# Altium project MultiSpikeHold.PrjPcb
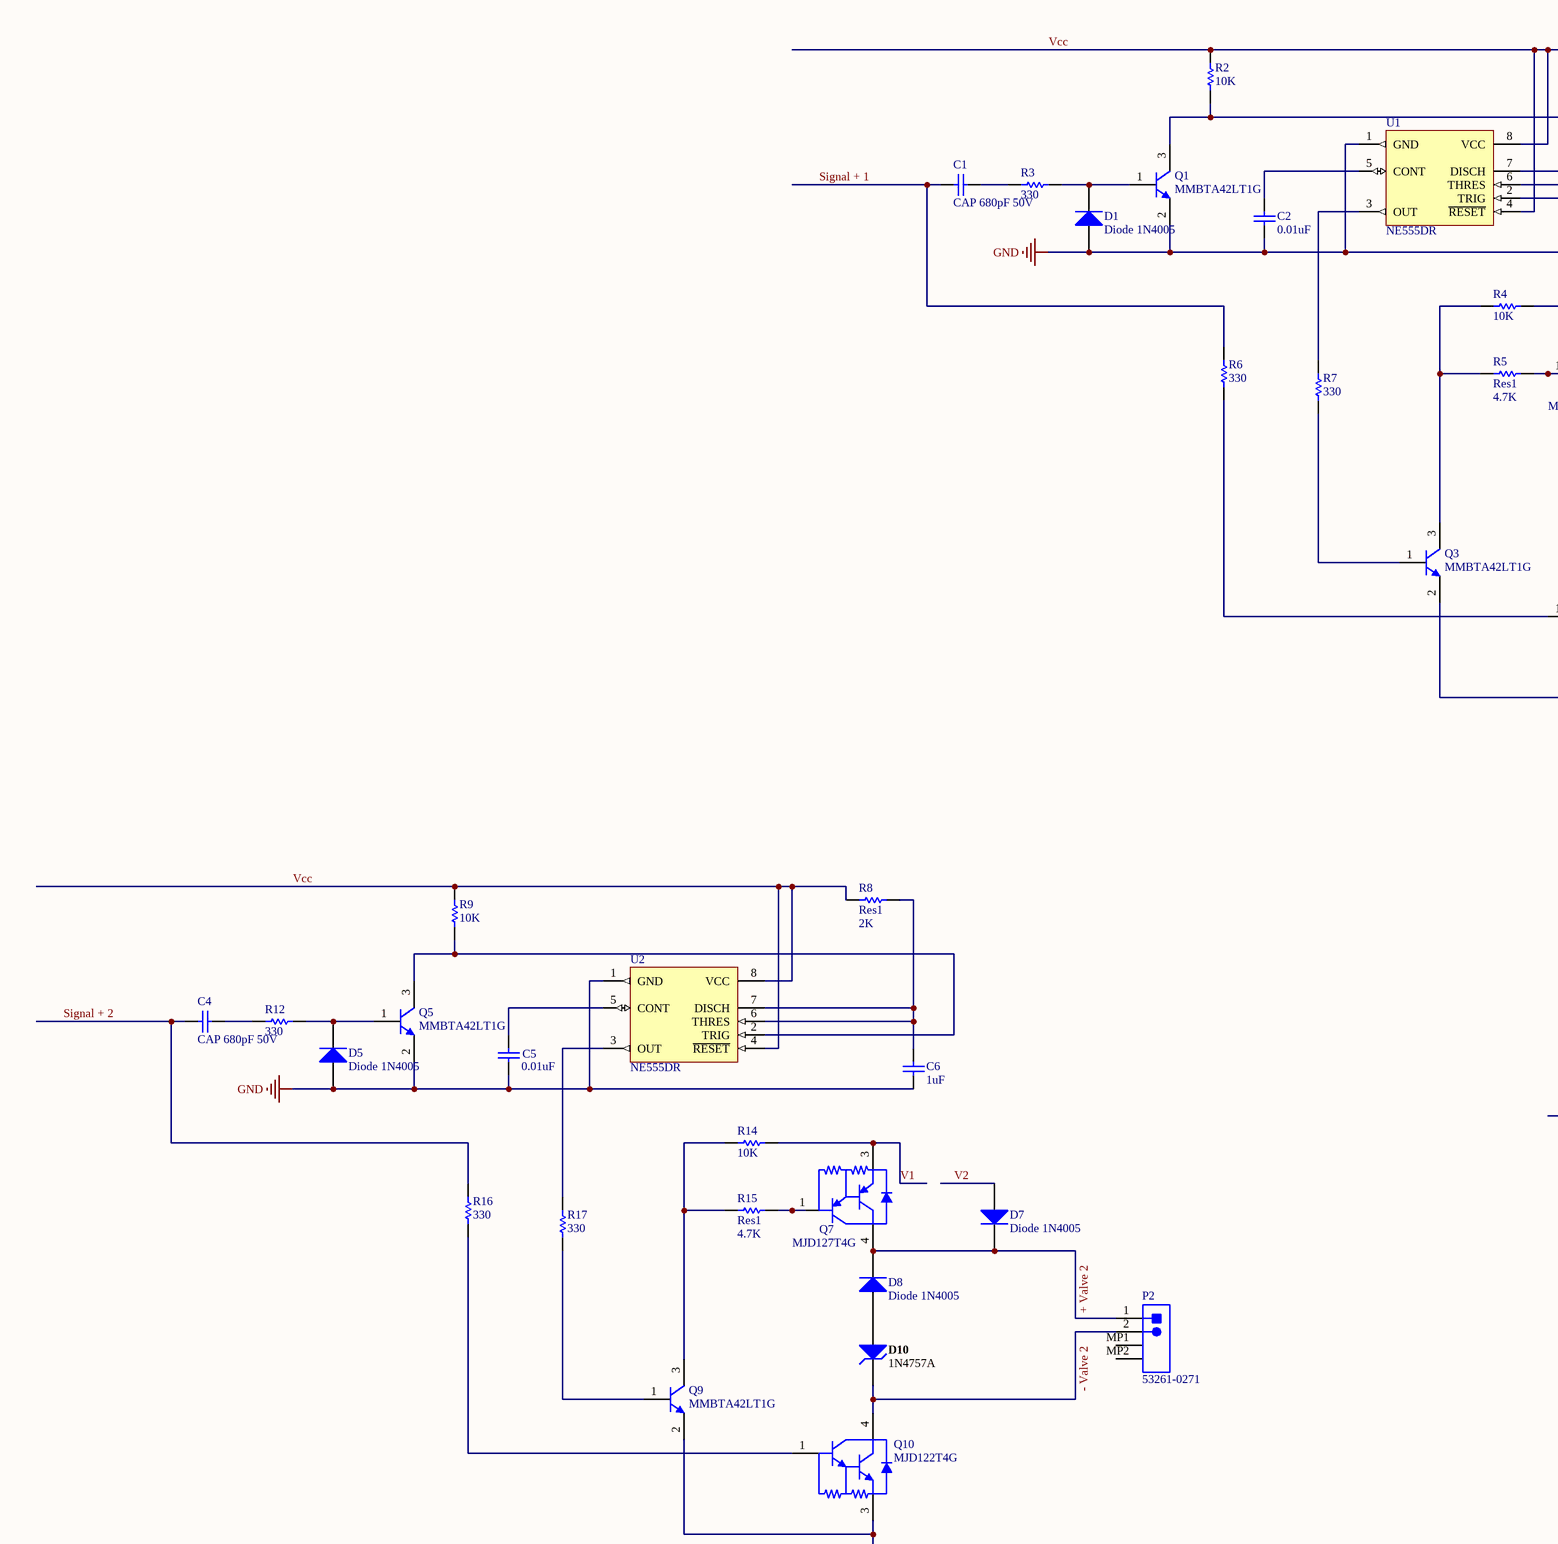
[diagram p0: MultiSpikeHoldSchem.SchDoc, top left]
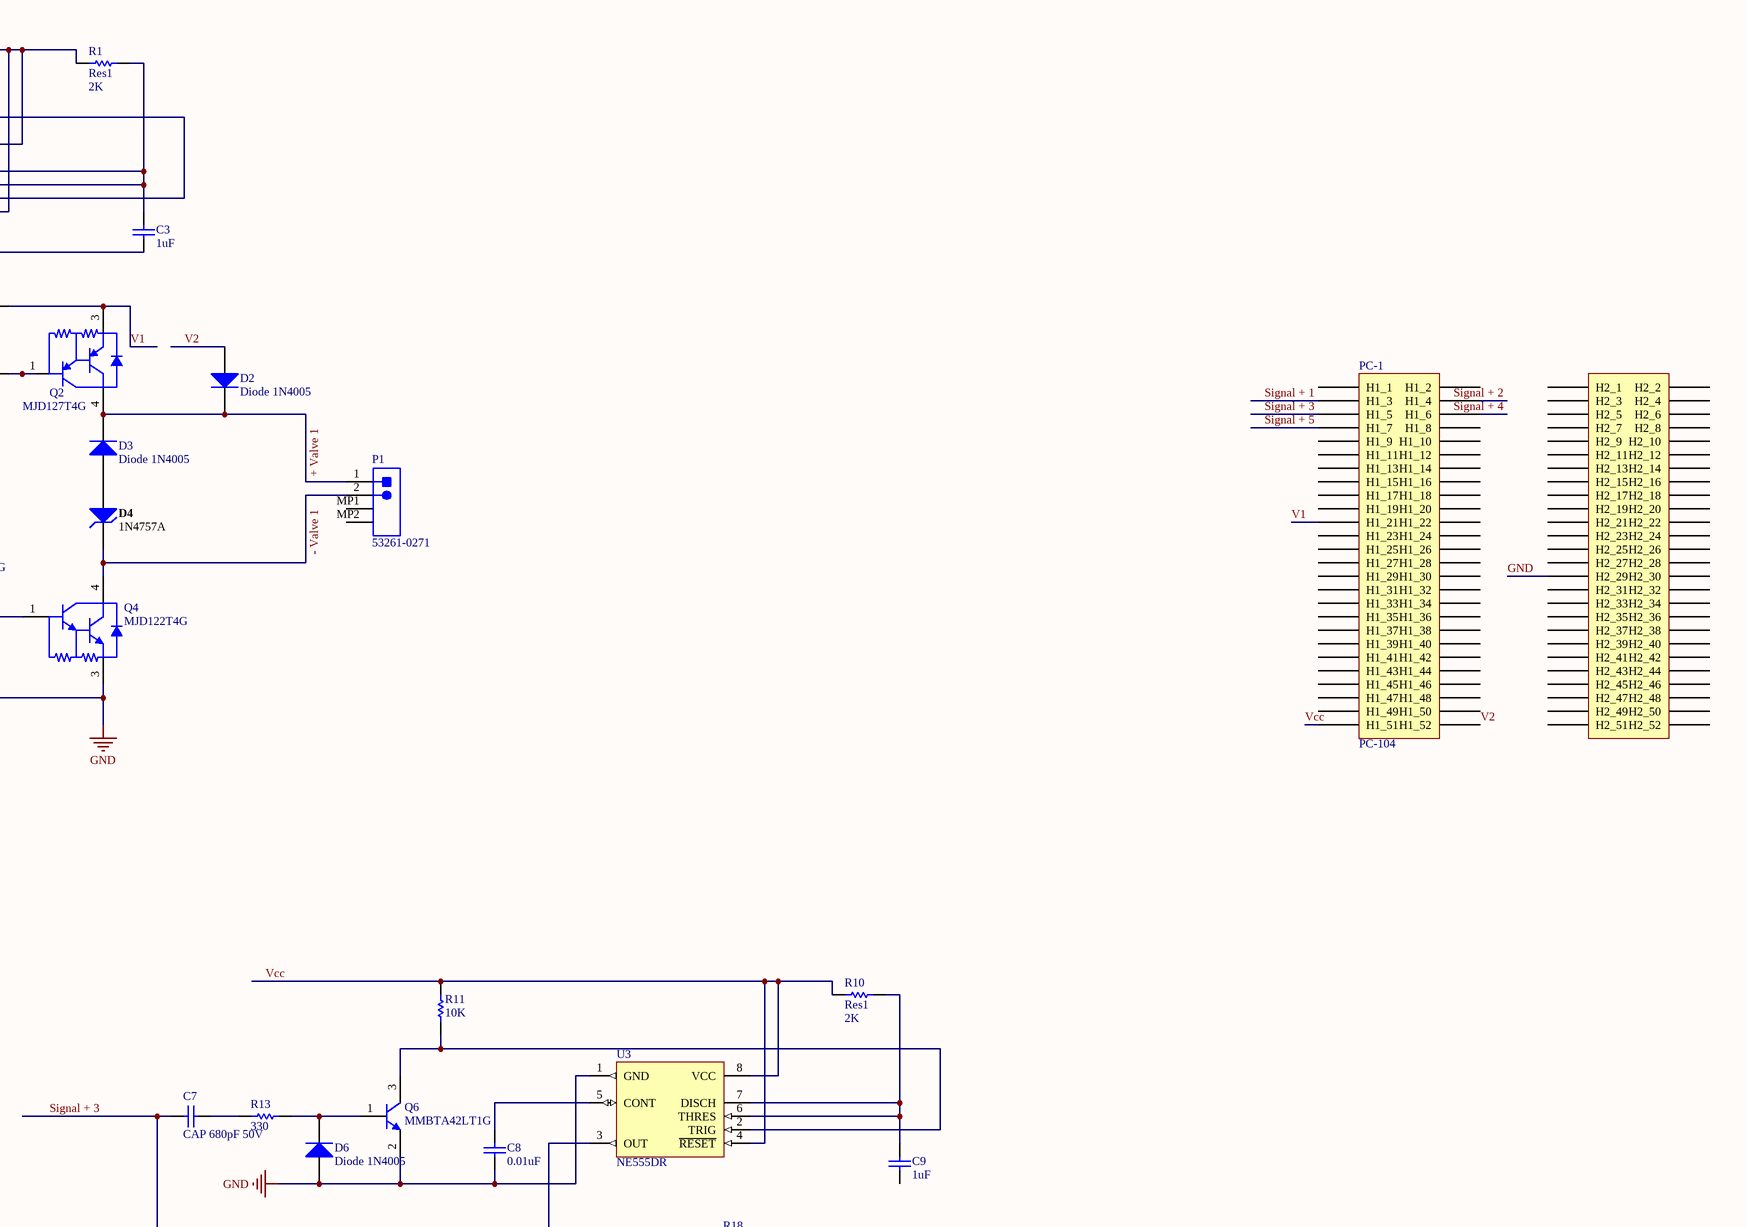
[diagram p1: MultiSpikeHoldSchem.SchDoc, top right]
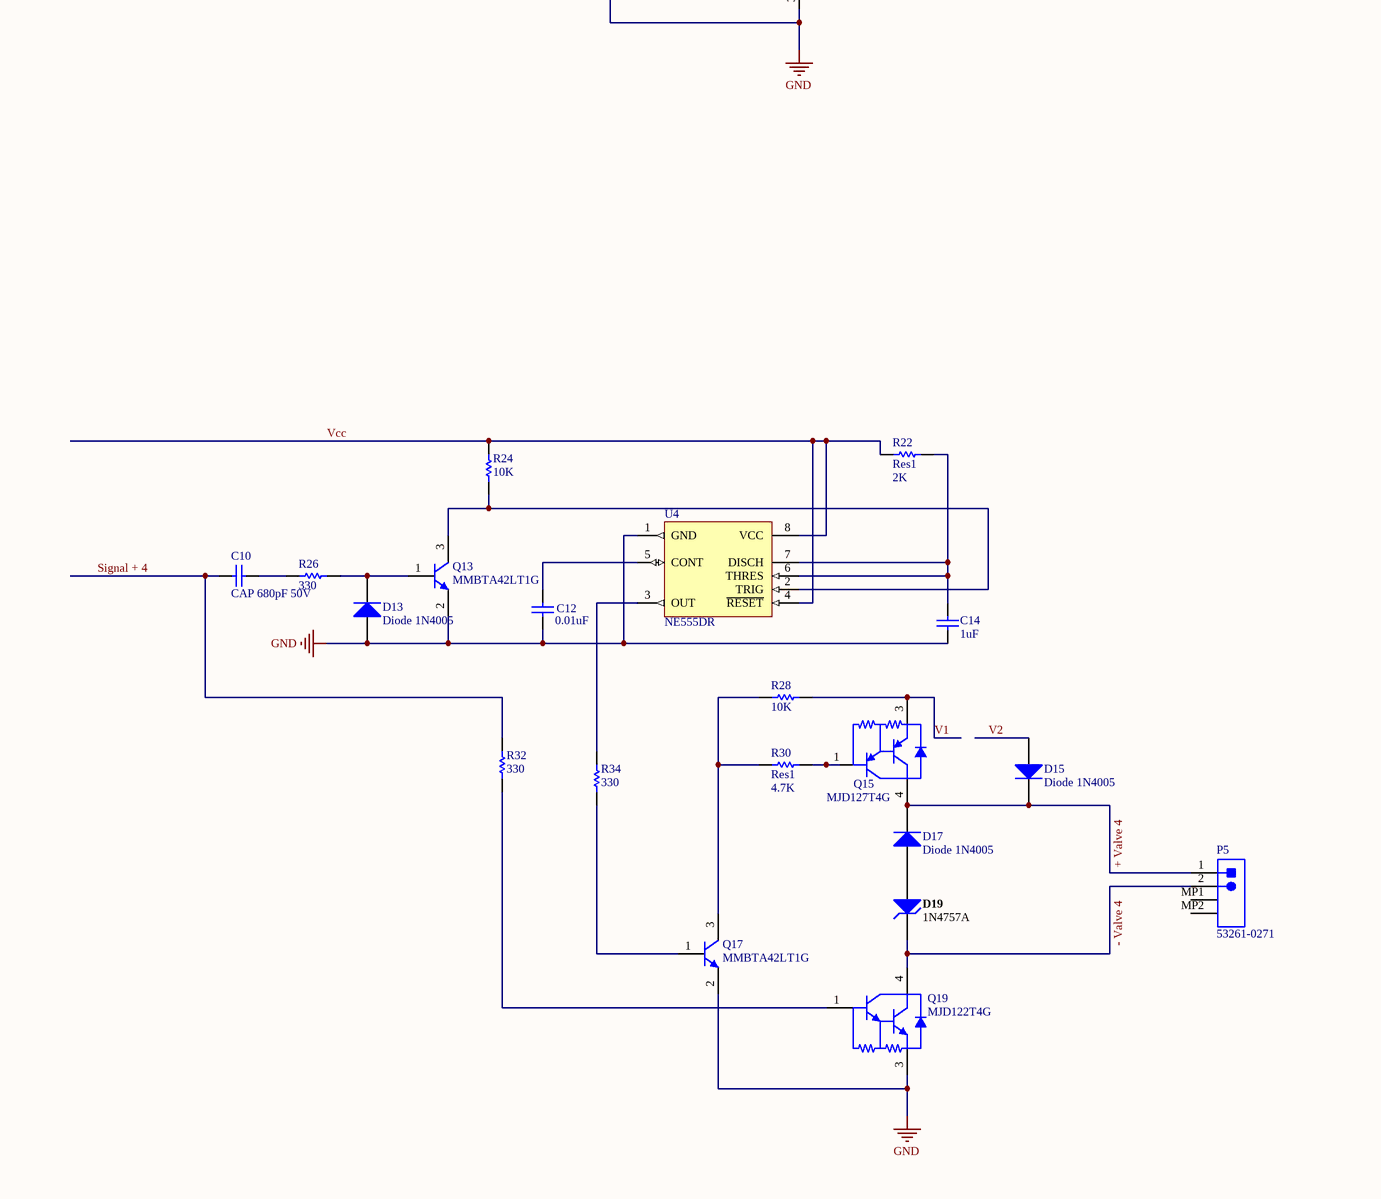
[diagram p2: MultiSpikeHoldSchem.SchDoc, bottom left]
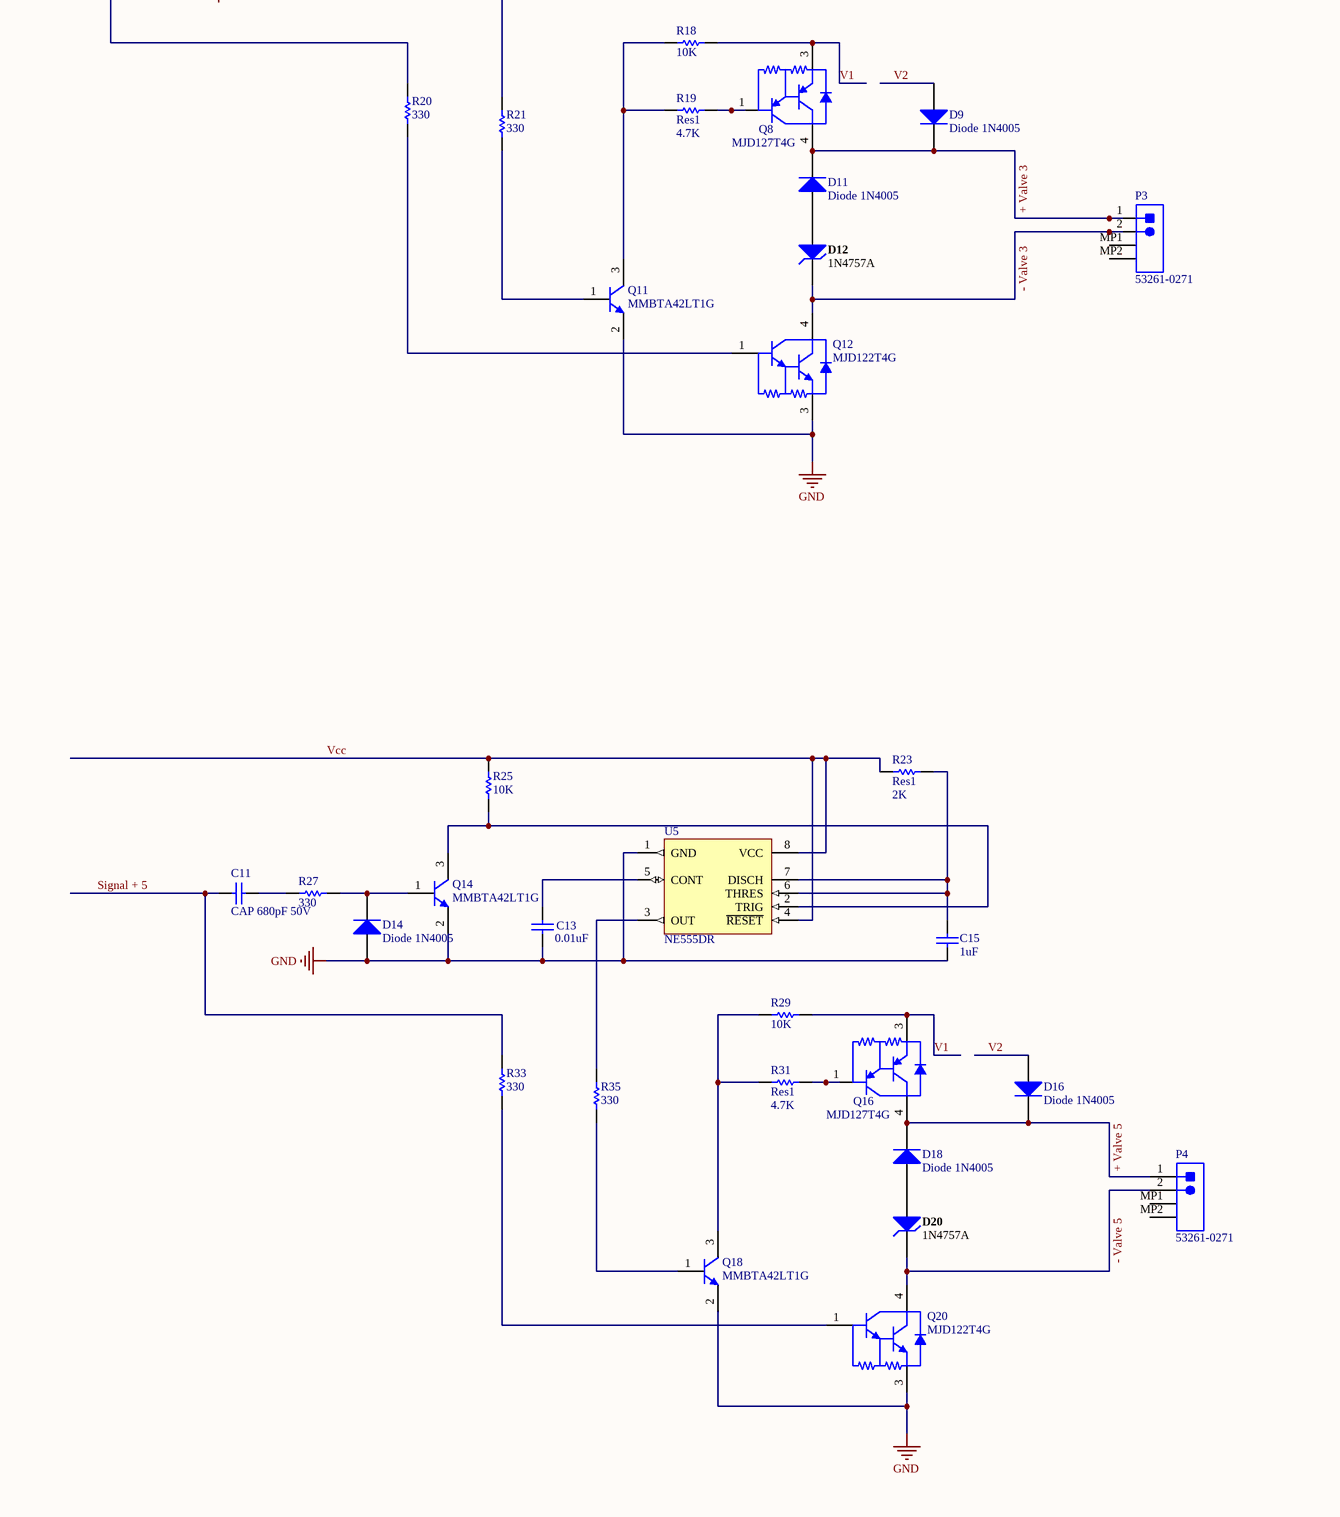
[diagram p3: MultiSpikeHoldSchem.SchDoc, bottom right]
1 sheet, 101 parts. Net scope: global (net labels, ports and power ports of the same name join across sheets).
Board file: MultiSpikeHoldPCB.PcbDoc

## Sheet MultiSpikeHoldSchem.SchDoc
size A1

### Parts
C1  CAP 680pF 50V  [CAPC1812(4532)230_L]
C2  0.01uF  [CAPC2013X70X45ML10T25]
C3  1uF  [CAPC1206(3216)110_L]
C4  CAP 680pF 50V  [CAPC1812(4532)230_L]
C5  0.01uF  [CAPC2013X70X45ML10T25]
C6  1uF  [CAPC1206(3216)110_L]
C7  CAP 680pF 50V  [CAPC1812(4532)230_L]
C8  0.01uF  [CAPC2013X70X45ML10T25]
C9  1uF  [CAPC1206(3216)110_L]
C10  CAP 680pF 50V  [CAPC1812(4532)230_L]
C11  CAP 680pF 50V  [CAPC1812(4532)230_L]
C12  0.01uF  [CAPC2013X70X45ML10T25]
C13  0.01uF  [CAPC2013X70X45ML10T25]
C14  1uF  [CAPC1206(3216)110_L]
C15  1uF  [CAPC1206(3216)110_L]
D1  Diode 1N4005  [DO-41]
D2  Diode 1N4005  [DO-41]
D3  Diode 1N4005  [DO-41]
D4  1N4757A  [FAIR-DO-41-2_V]
D5  Diode 1N4005  [DO-41]
D6  Diode 1N4005  [DO-41]
D7  Diode 1N4005  [DO-41]
D8  Diode 1N4005  [DO-41]
D9  Diode 1N4005  [DO-41]
D10  1N4757A  [FAIR-DO-41-2_V]
D11  Diode 1N4005  [DO-41]
D12  1N4757A  [FAIR-DO-41-2_V]
D13  Diode 1N4005  [DO-41]
D14  Diode 1N4005  [DO-41]
D15  Diode 1N4005  [DO-41]
D16  Diode 1N4005  [DO-41]
D17  Diode 1N4005  [DO-41]
D18  Diode 1N4005  [DO-41]
D19  1N4757A  [FAIR-DO-41-2_V]
D20  1N4757A  [FAIR-DO-41-2_V]
P1  53261-0271  [MOLX-53261-0271_V]
P2  53261-0271  [MOLX-53261-0271_V]
P3  53261-0271  [MOLX-53261-0271_V]
P4  53261-0271  [MOLX-53261-0271_V]
P5  53261-0271  [MOLX-53261-0271_V]
PC-1  PC-104  [PC-104FOOTPRINT]
Q1  MMBTA42LT1G  [ONSC-SOT-23-3-318-08_V]
Q2  MJD127T4G  [ONSC-DPAK-3-369C-01_V]
Q3  MMBTA42LT1G  [ONSC-SOT-23-3-318-08_V]
Q4  MJD122T4G  [ONSC-DPAK-3-369C-01_V]
Q5  MMBTA42LT1G  [ONSC-SOT-23-3-318-08_V]
Q6  MMBTA42LT1G  [ONSC-SOT-23-3-318-08_V]
Q7  MJD127T4G  [ONSC-DPAK-3-369C-01_V]
Q8  MJD127T4G  [ONSC-DPAK-3-369C-01_V]
Q9  MMBTA42LT1G  [ONSC-SOT-23-3-318-08_V]
Q10  MJD122T4G  [ONSC-DPAK-3-369C-01_V]
Q11  MMBTA42LT1G  [ONSC-SOT-23-3-318-08_V]
Q12  MJD122T4G  [ONSC-DPAK-3-369C-01_V]
Q13  MMBTA42LT1G  [ONSC-SOT-23-3-318-08_V]
Q14  MMBTA42LT1G  [ONSC-SOT-23-3-318-08_V]
Q15  MJD127T4G  [ONSC-DPAK-3-369C-01_V]
Q16  MJD127T4G  [ONSC-DPAK-3-369C-01_V]
Q17  MMBTA42LT1G  [ONSC-SOT-23-3-318-08_V]
Q18  MMBTA42LT1G  [ONSC-SOT-23-3-318-08_V]
Q19  MJD122T4G  [ONSC-DPAK-3-369C-01_V]
Q20  MJD122T4G  [ONSC-DPAK-3-369C-01_V]
R1  Res1  value 2K  [AXIAL-0.3]
R2  10K  [RESC1608X55X25ML10T15]
R3  330  [RESC3116X65X40LL10T20]
R4  10K  [RESC1608X55X25ML10T15]
R5  Res1  value 4.7K  [AXIAL-0.3]
R6  330  [RESC3116X65X40LL10T20]
R7  330  [RESC3116X65X40LL10T20]
R8  Res1  value 2K  [AXIAL-0.3]
R9  10K  [RESC1608X55X25ML10T15]
R10  Res1  value 2K  [AXIAL-0.3]
R11  10K  [RESC1608X55X25ML10T15]
R12  330  [RESC3116X65X40LL10T20]
R13  330  [RESC3116X65X40LL10T20]
R14  10K  [RESC1608X55X25ML10T15]
R15  Res1  value 4.7K  [AXIAL-0.3]
R16  330  [RESC3116X65X40LL10T20]
R17  330  [RESC3116X65X40LL10T20]
R18  10K  [RESC1608X55X25ML10T15]
R19  Res1  value 4.7K  [AXIAL-0.3]
R20  330  [RESC3116X65X40LL10T20]
R21  330  [RESC3116X65X40LL10T20]
R22  Res1  value 2K  [AXIAL-0.3]
R23  Res1  value 2K  [AXIAL-0.3]
R24  10K  [RESC1608X55X25ML10T15]
R25  10K  [RESC1608X55X25ML10T15]
R26  330  [RESC3116X65X40LL10T20]
R27  330  [RESC3116X65X40LL10T20]
R28  10K  [RESC1608X55X25ML10T15]
R29  10K  [RESC1608X55X25ML10T15]
R30  Res1  value 4.7K  [AXIAL-0.3]
R31  Res1  value 4.7K  [AXIAL-0.3]
R32  330  [RESC3116X65X40LL10T20]
R33  330  [RESC3116X65X40LL10T20]
R34  330  [RESC3116X65X40LL10T20]
R35  330  [RESC3116X65X40LL10T20]
U1  NE555DR  [D0008A_L]
U2  NE555DR  [D0008A_L]
U3  NE555DR  [D0008A_L]
U4  NE555DR  [D0008A_L]
U5  NE555DR  [D0008A_L]

### Nets
GND: C2.1 C3.1 C5.1 C6.1 C8.1 C12.1 C13.1 C14.1 C15.1 D1.1(A) D5.1(A) D6.1(A) D13.1(A) D14.1(A) PC-1.H2_29 Q1.2(E) Q3.2(E) Q4.3(E) Q5.2(E) Q6.2(E) Q9.2(E) Q10.3(E) Q11.2(E) Q12.3(E) Q13.2(E) Q14.2(E) Q17.2(E) Q18.2(E) Q19.3(E) Q20.3(E) U1.1(GND) U2.1(GND) U3.1(GND) U4.1(GND) U5.1(GND)
+ Valve 1: D2.2(K) D3.2(K) P1.1 Q2.4(C)
+ Valve 2: D7.2(K) D8.2(K) P2.1 Q7.4(C)
+ Valve 3: D9.2(K) D11.2(K) P3.1 Q8.4(C)
+ Valve 4: D15.2(K) D17.2(K) P5.1 Q15.4(C)
+ Valve 5: D16.2(K) D18.2(K) P4.1 Q16.4(C)
- Valve 1: D4.2(K) P1.2 Q4.4(C)
- Valve 2: D10.2(K) P2.2 Q10.4(C)
- Valve 3: D12.2(K) P3.2 Q12.4(C)
- Valve 4: D19.2(K) P5.2 Q19.4(C)
- Valve 5: D20.2(K) P4.2 Q20.4(C)
Signal + 1: C1.1 PC-1.H1_3 R6.2
Signal + 2: C4.1 R16.2
Signal + 3: C7.1 PC-1.H1_5 R20.2
Signal + 4: C10.1 R32.2
Signal + 5: C11.1 PC-1.H1_7 R33.2
V1: PC-1.H1_21 Q2.3(E) Q7.3(E) Q8.3(E) Q15.3(E) Q16.3(E) R4.2 R14.1 R18.1 R28.2 R29.2
V2: D2.1(A) D7.1(A) D9.1(A) D15.1(A) D16.1(A) PC-1.H1_52
Vcc: PC-1.H1_51 R1.1 R2.1 R8.1 R9.2 R10.1 R11.1 R22.1 R23.1 R24.1 R25.1 U1.4(~{RESET}) U1.8(VCC) U2.4(~{RESET}) U2.8(VCC) U3.4(~{RESET}) U3.8(VCC) U4.4(~{RESET}) U4.8(VCC) U5.4(~{RESET}) U5.8(VCC)
NetC1_2: C1.2 R3.1
NetC2_2: C2.2 U1.5(CONT)
NetC3_2: C3.2 R1.2 U1.6(THRES) U1.7(DISCH)
NetC4_2: C4.2 R12.1
NetC5_2: C5.2 U2.5(CONT)
NetC6_2: C6.2 R8.2 U2.6(THRES) U2.7(DISCH)
NetC7_2: C7.2 R13.1
NetC8_2: C8.2 U3.5(CONT)
NetC9_2: C9.2 R10.2 U3.6(THRES) U3.7(DISCH)
NetC10_2: C10.2 R26.1
NetC11_2: C11.2 R27.1
NetC12_2: C12.2 U4.5(CONT)
NetC13_2: C13.2 U5.5(CONT)
NetC14_2: C14.2 R22.2 U4.6(THRES) U4.7(DISCH)
NetC15_2: C15.2 R23.2 U5.6(THRES) U5.7(DISCH)
NetD1_2: D1.2(K) Q1.1(B) R3.2
NetD3_1: D3.1(A) D4.1(A)
NetD5_2: D5.2(K) Q5.1(B) R12.2
NetD6_2: D6.2(K) Q6.1(B) R13.2
NetD8_1: D8.1(A) D10.1(A)
NetD11_1: D11.1(A) D12.1(A)
NetD13_2: D13.2(K) Q13.1(B) R26.2
NetD14_2: D14.2(K) Q14.1(B) R27.2
NetD17_1: D17.1(A) D19.1(A)
NetD18_1: D18.1(A) D20.1(A)
NetQ1_3: Q1.3(C) R2.2 U1.2(TRIG)
NetQ2_1: Q2.1(B) R5.2
NetQ3_1: Q3.1(B) R7.1
NetQ3_3: Q3.3(C) R4.1 R5.1
NetQ4_1: Q4.1(B) R6.1
NetQ5_3: Q5.3(C) R9.1 U2.2(TRIG)
NetQ6_3: Q6.3(C) R11.2 U3.2(TRIG)
NetQ7_1: Q7.1(B) R15.2
NetQ8_1: Q8.1(B) R19.2
NetQ9_1: Q9.1(B) R17.1
NetQ9_3: Q9.3(C) R14.2 R15.1
NetQ10_1: Q10.1(B) R16.1
NetQ11_1: Q11.1(B) R21.1
NetQ11_3: Q11.3(C) R18.2 R19.1
NetQ12_1: Q12.1(B) R20.1
NetQ13_3: Q13.3(C) R24.2 U4.2(TRIG)
NetQ14_3: Q14.3(C) R25.2 U5.2(TRIG)
NetQ15_1: Q15.1(B) R30.2
NetQ16_1: Q16.1(B) R31.2
NetQ17_1: Q17.1(B) R34.1
NetQ17_3: Q17.3(C) R28.1 R30.1
NetQ18_1: Q18.1(B) R35.1
NetQ18_3: Q18.3(C) R29.1 R31.1
NetQ19_1: Q19.1(B) R32.1
NetQ20_1: Q20.1(B) R33.1
NetR7_2: R7.2 U1.3(OUT)
NetR17_2: R17.2 U2.3(OUT)
NetR21_2: R21.2 U3.3(OUT)
NetR34_2: R34.2 U4.3(OUT)
NetR35_2: R35.2 U5.3(OUT)

Not connected (* = marked no-connect by the designer): C9 1; P1 MP1 MP2; P2 MP1 MP2; P3 MP1 MP2; P4 MP1 MP2; P5 MP1 MP2; PC-1 H1_1 H1_2 H1_4 H1_6 H1_8 H1_9 H1_10 H1_11 H1_12 H1_13 H1_14 H1_15 H1_16 H1_17 H1_18 H1_19 H1_20 H1_22 H1_23 H1_24 H1_25 H1_26 H1_27 H1_28 H1_29 H1_30 H1_31 H1_32 H1_33 H1_34 H1_35 H1_36 H1_37 H1_38 H1_39 H1_40 H1_41 H1_42 H1_43 H1_44 H1_45 H1_46 H1_47 H1_48 H1_49 H1_50 H2_1 H2_2 H2_3 H2_4 H2_5 H2_6 H2_7 H2_8 H2_9 H2_10 H2_11 H2_12 H2_13 H2_14 H2_15 H2_16 H2_17 H2_18 H2_19 H2_20 H2_21 H2_22 H2_23 H2_24 H2_25 H2_26 H2_27 H2_28 H2_30 H2_31 H2_32 H2_33 H2_34 H2_35 H2_36 H2_37 H2_38 H2_39 H2_40 H2_41 H2_42 H2_43 H2_44 H2_45 H2_46 H2_47 H2_48 H2_49 H2_50 H2_51 H2_52

### Notes on the sheet
- Labels drawn without touching a wire or pin: Signal + 2, Signal + 4

### Library data of the parts
C1 C4 C7 C10 C11 = CMP-1040-00233-1: CAP 680pF 50V ±5% 1812 (4532 Metric) Thickness 2.3mm SMD; Case-EIA: 1812; Case-Metric: 4532; Tolerance: Â±5%; Rated Voltage: 50 V; Technology: SMT; Value: 680pF; Max Thickness: 2.3 mm
C2 C5 C8 C12 C13 = CMP-2000-05013-1: Chip Capacitor, 10 nF, +/- 10%, 50 V, -55 to 125 degC, 0805 (2012 Metric), RoHS, Tape and Reel; Manufacturer: Murata; Voltage Rating DC: 50V; Temperature Coefficient / Code: +/-15%; Capacitance - pF: 10000pF; Case Height: 0.6mm; Dielectric: X7R; Case Length: 2mm; Case Width: 1.25mm; Type: GeneralPurposeMLCC; Brand: MurataElectronics; Capacitance - nF: 10nF; Capacitance: 0.01uF; Tolerance: 10%; Product Category: MultilayerCeramicCapacitorsMLCC-SMD/SMT; Minimum Operating Temperature: -55C; Voltage Rating: 50V; Series: GRM; Packaging: Reel; Dimensions: 1.25mmWx2mmLx0.6mmH; Operating Temperature Range: -55Cto+125C; Package / Case: 0805(2012metric); Datasheet URL: https://datasheet.ciiva.com/29201/452521-da-01-en-vs-kondensator-0805-29201121.pdf; Maximum Operating Temperature: +125C; Factory Pack Quantity: 4000; Case Code - in: 0805; Case Code - mm: 2012; Manufacturer URL: http://www.murata.com/; Termination Style: SMD/SMT; Datasheet Version: Dec-10; RoHS: Details; Product: GeneralTypeMLCCs
C3 C6 C9 C14 C15 = CMP-1037-04718-1: CAP 1uF 50V ±10% 1206 (3216 Metric) Thickness 1.1mm SMD; Tolerance: Â±10%; Case-EIA: 1206; Case-Metric: 3216; Rated Voltage: 50 V; Max Thickness: 1.1 mm; Value: 1uF; Technology: SMT
D1-D3 D5-D9 D11 D13-D18 = Diode 1N4005: 1 Amp General Purpose Rectifier; Published: 8-Jun-2000; LatestRevisionDate: 17-Jul-2002; LatestRevisionNote: Re-released for DXP Platform.; DatasheetVersion: 1998; PackageVersion: Aug-1999; PackageReference: DO-41; Publisher: Altium Limited; PackageDescription: Diode, Axial; Body 5.2 x 2.7 mm (LxDia. max), Lead Dia. 0.86 mm (max); Code_JEDEC: DO-204-AL; ComponentLink1Description: Manufacturer Link; ComponentLink1URL: http://www.fairchildsemi.com/; ComponentLink2Description: Datasheet; ComponentLink2URL: http://www.fairchildsemi.com/ds/1N%2F1N4001.pdf
D4 D10 D12 D19 D20 = CMP-0892-00018-1: Zener Diode, 51V, 1W, 5%, -65 to 200 degC, 2-Pin DO-41, Body 2.72 x 5.2 mm, RoHS; Manufacturer: Fairchild Semiconductor; Test Current IZ (mA): 5; ZZ (Max) (ohm): 95; VZ (Min.) (V): 48.45; VZ (Max.) (V): 53.55; PD (W): 1; Mounting Technology: Through Hole; ComponentLink2Description: Datasheet; ComponentLink1Description: Manufacturer URL; ComponentLink2URL: http://www.fairchildsemi.com/ds/1N/1N4744A.pdf; PackageReference: DO-41-2; PartNumber: 1N4757A; Tolerance: 5%; ComponentLink3URL: http://www.fairchildsemi.com/dwg/DO/DO41A.pdf; IR (uA): 5; PackageDescription: 2-Pin Axial leaded, Body 2.72 x 5.2 mm, Lead Spread 25.4 mm; ComponentLink3Description: Package Specification; RoHS: TRUE; DatasheetVersion: Rev. H3; ComponentLink1URL: http://www.fairchildsemi.com/; PackageVersion: Rev. 2; Operating and Storage Temperature Range: -65 to 200 degC
P1-P5 = CMP-2000-05633-1: PicoBlade(TM) Header, Right Angle, -40 to 85 degC, 2-Pin SMD, RoHS, Tape and Reel; Current - Max: 1A; Brand: Molex; Voltage Rating: 125V; Number of Positions: 2; Pitch: 1.25mm; Package Version: Rev. H, 11/2014; Factory Pack Quantity: 1000; Datasheet URL: http://www.molex.com/webdocs/datasheets/pdf/en-us/0532610271_PCB_HEADERS.pdf; Datasheet Version: 03/2016; Housing Material: Thermoplastic; RoHS: Details; Product Type: Headers; Number of Rows: 1; Termination Style: SMD; Mounting Technology: SurfaceMount; Number of Positions / Contacts: 2; Package URL: http://www.molex.com/pdm_docs/sd/532610271_sd.pdf; Mounting Angle: Right; Mounting Style: SMD/SMT; Manufacturer: Molex; Product Category: 1.25mmConnectors; Tradename: PicoBlade; Voltage - Max: 125V; Manufacturer URL: http://www.molex.com/; Series: 53261; Package Description: 2-Leads Header, Pitch 1.25 mm, Mated Height 3.4 mm; Package Reference: 53261-0271; Current Rating: 1A; Contact Plating: Tin; Contact Material: PhosphorBronze; Type: Shrouded; Packaging: Reel
Q1 Q3 Q5 Q6 Q9 Q11 Q13 Q14 Q17 Q18 = CMP-1048-00662-1: High Voltage Transistor, NPN Silicon, 3-Pin SOT-23, Pb-Free, Tape and Reel; Manufacturer: On Semiconductor; fT Min (MHz): 50; IC Continuous (A): 0.5; ComponentLink1URL: http://www.onsemi.com/; ComponentLink3URL: http://www.onsemi.cn/pub_link/Collateral/318-08.PDF; RoHS: TRUE; ComponentLink2Description: Datasheet; PartNumber: MMBTA42LT1G; Polarity: NPN; DatasheetVersion: Rev. 12; PackageReference: SOT-23-3-318-08; PackageDescription: 3-Pin Small Outline Transistor, Body 2.92 x 1.3 mm, Pitch 0.95 mm; ComponentLink3Description: Package Specification; ComponentLink1Description: Manufacturer URL; Packing: Tape and Reel; PackageVersion: Rev. AP, 11/2009; Mounting Technology: Surface Mount; ComponentLink2URL: http://www.onsemi.cn/pub_link/Collateral/MMBTA42LT1-D.PDF
Q2 Q7 Q8 Q15 Q16 = CMP-1047-00009-1: Complementary Darlington Power Transistor, 3-Pin DPAK, Pb-Free, Tape and Reel; Manufacturer: On Semiconductor; Polarity: PNP; IC Continuous (A): 8; hFE Max (k): 12; ComponentLink3URL: http://www.onsemi.cn/pub_link/Collateral/369C.PDF; PackageReference: DPAK-3-369C-01; RoHS: TRUE; PartNumber: MJD127T4G; ComponentLink2URL: http://www.onsemi.com/pub_link/Collateral/MJD122-D.PDF; PackageDescription: 3-Pin Flange Mount, Body 6.54 x 6.095 mm, Pitch 2.29 mm; Mounting Technology: Surface Mount; Packing: Tape and Reel; DatasheetVersion: Rev. 13; ComponentLink2Description: Datasheet; ComponentLink3Description: Package Specification; ComponentLink1URL: http://www.onsemi.com/; ComponentLink1Description: Manufacturer URL; PackageVersion: Rev. E, 02/2014
Q4 Q10 Q12 Q19 Q20 = CMP-1047-00007-1: Complementary Darlington Power Transistor, 3-Pin DPAK, Pb-Free, Tape and Reel; Manufacturer: On Semiconductor; IC Continuous (A): 8; hFE Max (k): 12; Polarity: NPN; ComponentLink1Description: Manufacturer URL; ComponentLink3URL: http://www.onsemi.cn/pub_link/Collateral/369C.PDF; Mounting Technology: Surface Mount; RoHS: TRUE; ComponentLink2Description: Datasheet; ComponentLink1URL: http://www.onsemi.com/; ComponentLink3Description: Package Specification; DatasheetVersion: Rev. 13; PackageDescription: 3-Pin Flange Mount, Body 6.54 x 6.095 mm, Pitch 2.29 mm; PartNumber: MJD122T4G; ComponentLink2URL: http://www.onsemi.com/pub_link/Collateral/MJD122-D.PDF; PackageVersion: Rev. E, 02/2014; PackageReference: DPAK-3-369C-01; Packing: Tape and Reel
R1 R5 R8 R10 R15 R19 R22 R23 R30 R31 = Res1: Resistor; Published: 8-Jun-2000; LatestRevisionDate: 17-Jul-2002; LatestRevisionNote: Re-released for DXP Platform.; PackageReference: AXIAL-0.3; Publisher: Altium Limited; PackageDescription: Axial Device, Thru-Hole; 2 Leads; 0.3 in Pin Spacing
R2 R4 R9 R11 R14 R18 R24 R25 R28 R29 = CMP-2100-03664-1: Chip Resistor, 10 KOhm, +/- 1%, 01 W, -55 to 155 degC, 0603 (1608 Metric), RoHS, Tape and Reel; Manufacturer: Yageo; Temperature Coefficient: 100ppm/degreesC; Resistance: 10KOhm; Voltage Rating: 75V; Power Rating: 100mW; Voltage Rating (DC): 50V; Composition: ThickFilm; RoHSCompliant: true; Height: 0.45mm; Lead Free: LeadFree; Case Code (Metric): 1608; Case/Package: 0603; Datasheet Version: Rev. 5, 10/2016; Package Reference: 0603; Depth: 0.8mm; Package Description: 2-Pin Surface Mount Device, Body 1.6 x 0.8 mm; Case Code (Imperial): 0603; Packaging: TapeandReel; Termination: SMD/SMT; Lead Pitch: 0.3mm; Width: 0.8mm; Number of Pins: 2; Length: 1.6mm; REACH SVHC: NoSVHC; Military Standard: Not; Max Operating Temperature: 155degC; Min Operating Temperature: -55degC; Manufacturer URL: http://www.yageo.com/; Datasheet URL: http://www.yageo.com/NewPortal/yageodocoutput?fileName=/pdf/R-Chip/PYu-RC_Group_51_RoHS_L_5.pdf; Weight: 7.1E-05oz; Tolerance: 1%
R3 R6 R7 R12 R13 R16 R17 R20 R21 R26 R27 R32-R35 = CMP-2000-06969-1: Chip Resistor, 330 Ohm, +/- 1%, 250 mW, -55 to 155 degC, 1206 (3216 Metric), RoHS, Tape and Reel; Manufacturer: Yageo; Voltage Rating: 200V; Power Rating: 250mW(1/4W); Resistance: 330Ohms; Temperature Coefficient: 100PPM/C; Product: ThickFilmResistorsGeneralPurpose; Operating Temperature Range: -55Cto+155C; Datasheet Version: Rev. 7, 05/2017; Case Code - in: 1206; Package Reference: 1206; Termination Style: SMD/SMT; Manufacturer URL: http://www.yageo.com/; Package Description: 2-Pin Surface Mount Device, Body 3.1 x 1.6 mm; Packaging: Reel; Tolerance: 1%; Mounting Technology: SurfaceMount; Case Code - mm: 3216; Datasheet URL: http://www.yageo.com/documents/recent/PYu-RC_Group_51_RoHS_L_7.pdf; Series: RC
U1-U5 = CMP-1685-00007-1: Precision Timer, 4.5 to 16 V, 0 to 70 degC, 8-Pin SOIC (D8), Green (RoHS & no Sb/Br), Tape and Reel; Forward Voltage: 450 mV; Forward Current: 1 A; Max Surge Current: 30 A; Peak Reverse Current: 500 uA; Case\Package: SMA; PackageReference: D0008A; Width: 2.84 mm; PackageDescription: 8-Pin Small Outline Integrated Circuit, Body 4.9 x 3.9 mm, Pitch 1.27 mm; DatasheetVersion: SLFS022I, 09/2014; ComponentLink2Description: Datasheet; Package Quantity: 1; REACH SVHC: Unknown; Radiation Hardening: No; Height: 2.44 mm; Code_JEDEC: MS-012; Pins: 2; ComponentLink1Description: Manufacturer URL; ComponentLink3Description: Package Specification; ComponentLink3URL: http://www.ti.com/lit/ml/msoi002j/msoi002j.pdf; Length: 4.57 mm; ComponentLink1URL: http://www.ti.com/; Mount: Surface Mount; PackageVersion: 4040047-3/M, 06/2011; ComponentLink2URL: http://www.ti.com/general/docs/lit/getliterature.tsp?genericPartNumber=NE555&fileType=pdf; RoHSCompliant: true; Max Operating Temperature: 125 degC; Packaging: Cut Tape; Min Operating Temperature: -55 degC